# EAGLE design sbus-inverter-pro-micro (EAGLE 9.5.2)
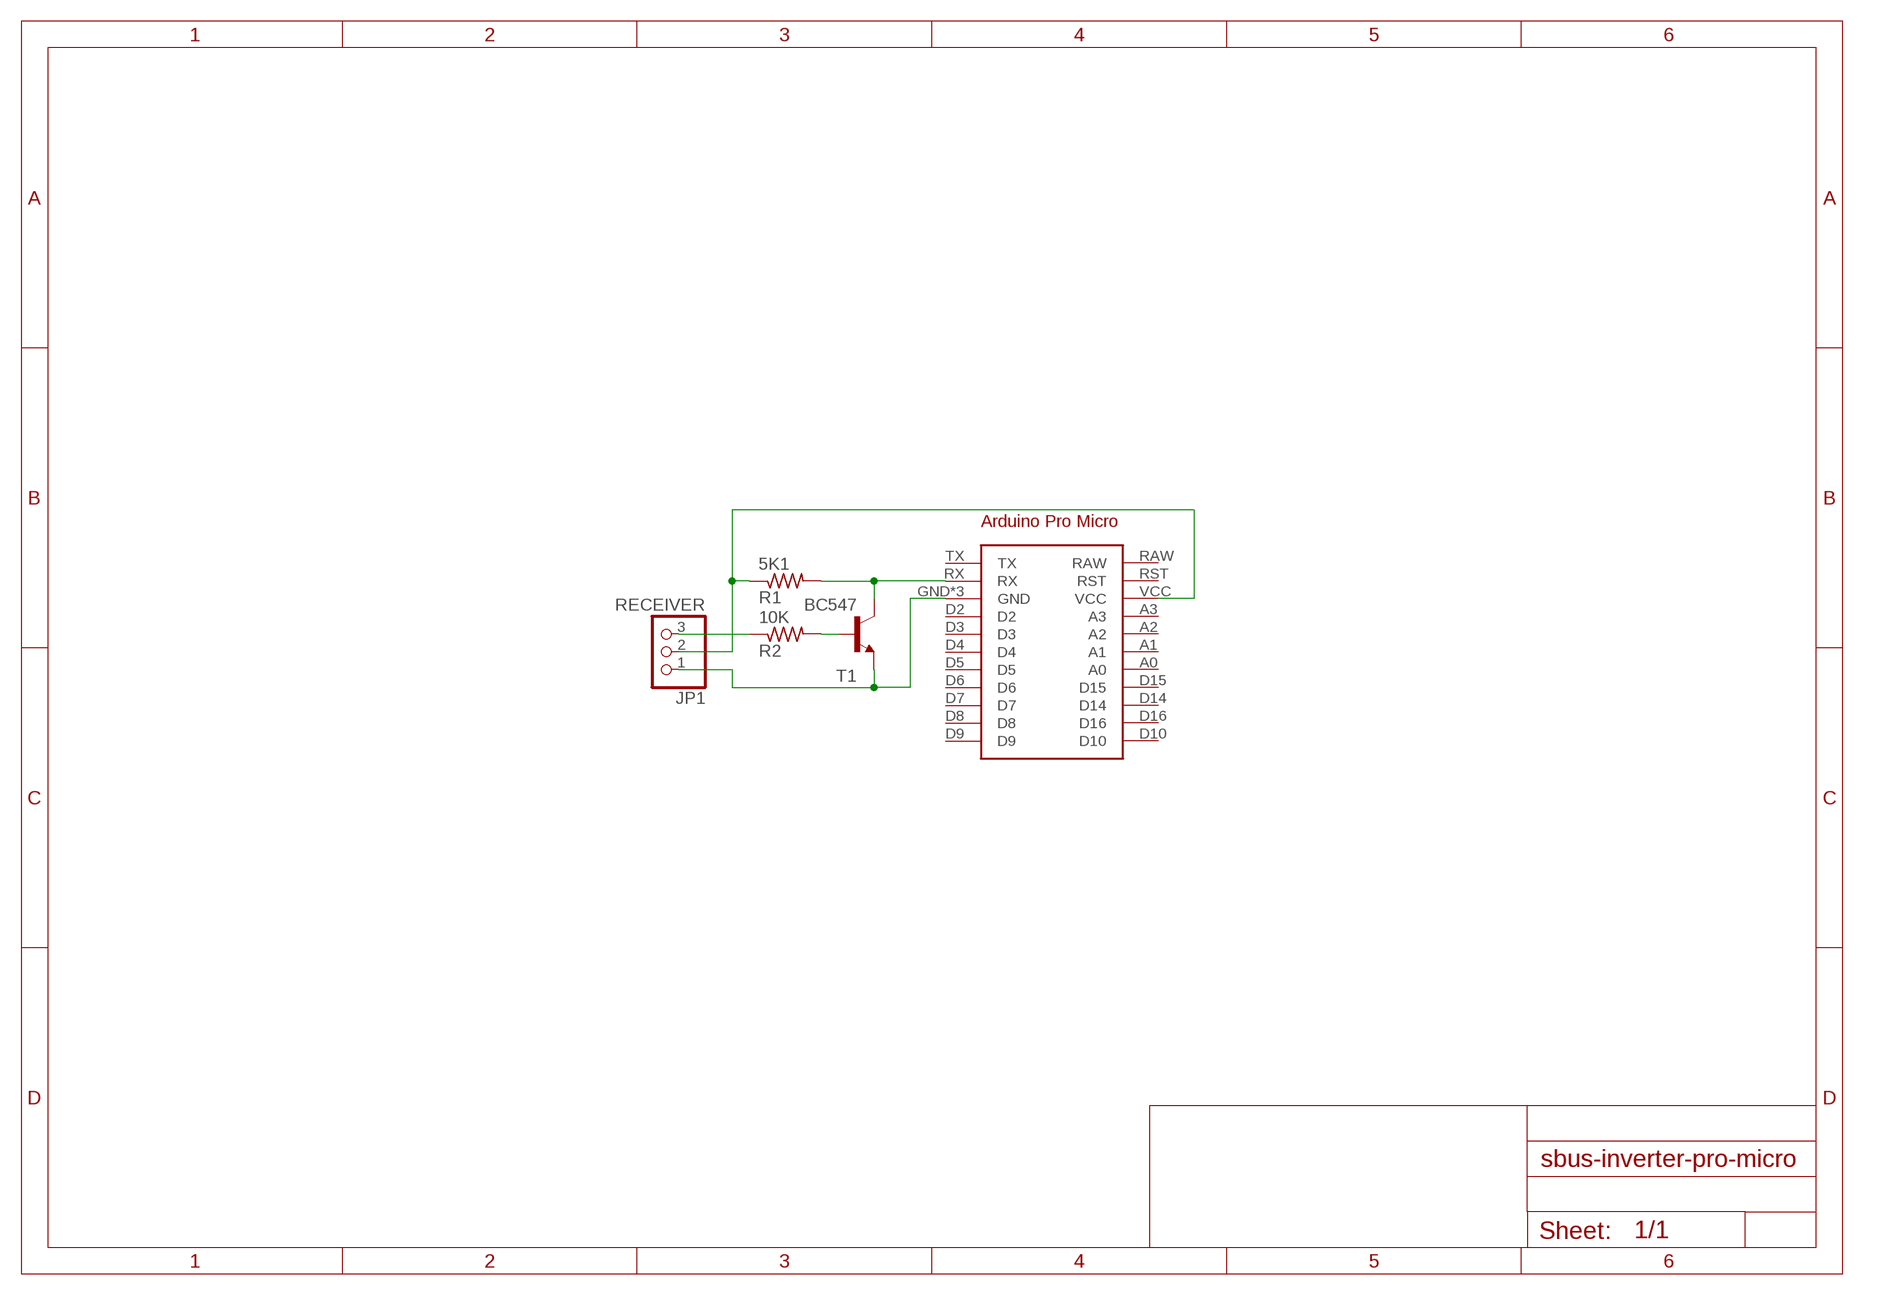
[diagram p0: schematic, sheet 1]

## Parts
ARDUINO1  ARDUINO_PRO_MICRO  [ARDUINO_PRO_MICRO]
JP1  RECEIVER  PINHD-1X3/90  [1X03/90]
R1  5K1  R-US_0207/10  [0207/10]
R2  10K  R-US_0207/10  [0207/10]
T1  BC547  [TO92]

## Nets
N$1: R2.2 T1.2(B)
N$2: ARDUINO1.GND ARDUINO1.GND@1(GND) ARDUINO1.GND@2(GND) JP1.1 T1.1(E)
N$3: ARDUINO1.RX R1.2 T1.3(C)
N$4: JP1.3 R2.1
N$5: ARDUINO1.VCC JP1.2 R1.1
Unconnected: ARDUINO1.A0 ARDUINO1.A1 ARDUINO1.A2 ARDUINO1.A3 ARDUINO1.D2 ARDUINO1.D3 ARDUINO1.D4 ARDUINO1.D5 ARDUINO1.D6 ARDUINO1.D7 ARDUINO1.D8 ARDUINO1.D9 ARDUINO1.D10 ARDUINO1.D14 ARDUINO1.D15 ARDUINO1.D16 ARDUINO1.RAW ARDUINO1.RST ARDUINO1.TX

## Library data of the parts
ARDUINO1 = arduinopromicro:ARDUINO_PRO_MICRO: For creating Arduino Pro Micro shields
JP1 = pinhead:PINHD-1X3: PIN HEADER
R1 R2 = rcl:R-US_: RESISTOR, American symbol; SPICEPREFIX: R
T1 = transistor:BC547: NPN TRANSISTOR

## Board
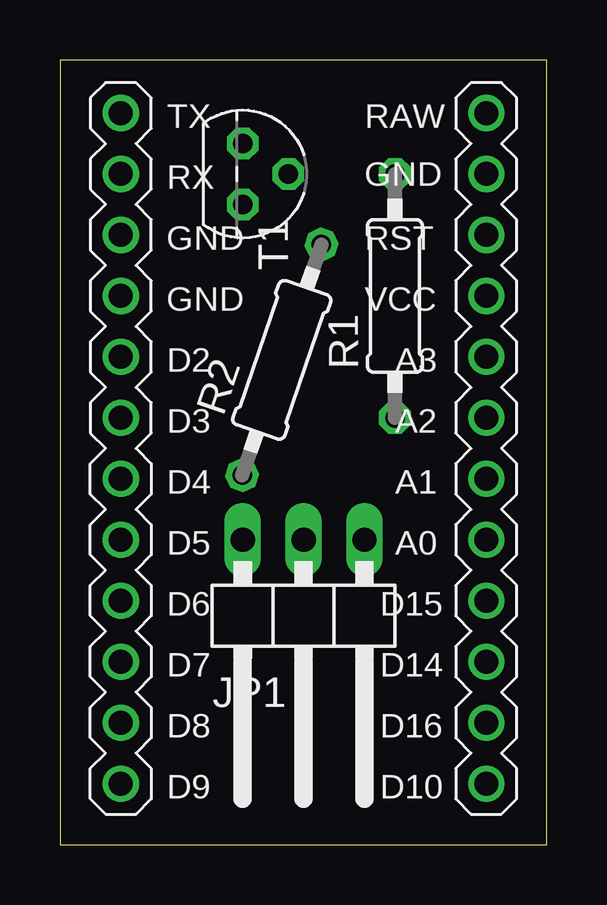
[diagram p1: board, top side]
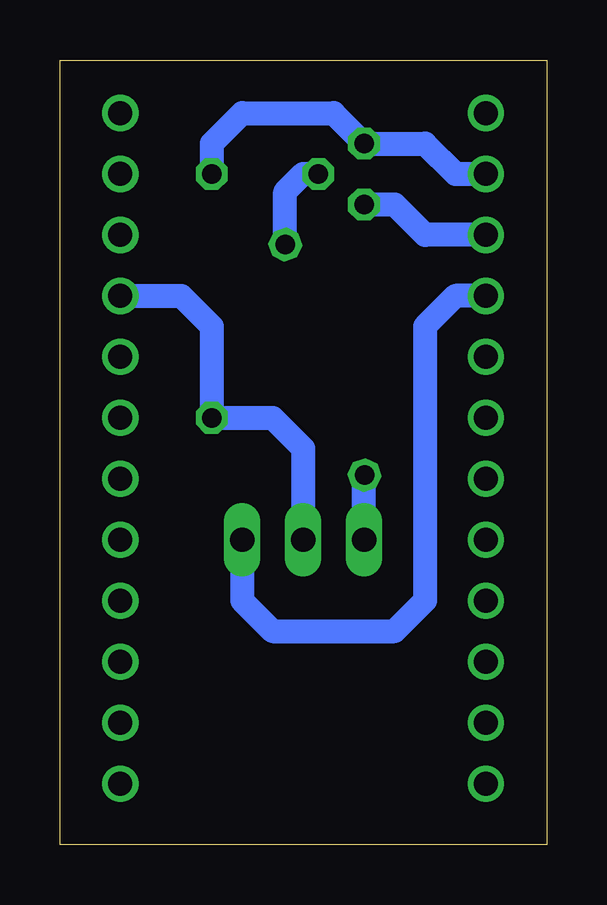
[diagram p2: board, bottom side, seen from below]

Size 20.3 x 32.69 mm. Coordinates in mm from the lower left corner, seen from the top.
Outline: 0,0 20.3,0 20.3,32.69 0,32.69 0,0
Copper layers (1*16): Top 0.035mm / dielectric 1.5mm / Bottom 0.035mm
Design rules "default": minimum track width 6mil, minimum drill 0.35mm, track to track 6mil, track to pad 6mil, pad to pad 6mil, via to via 6mil, smd to smd 6mil, copper to edge 40mil, drill to drill 6mil, minimum pad ring 10mil, minimum via ring 8mil, stop-mask expansion 4mil, vias tented up to drill 0mil, thermal gap 10mil

### Footprints (pad centres in the part's own frame; a part is rotated, then mirrored left to right if it is on the bottom)
ARDUINO_PRO_MICRO = drill 1: A0 7.62,-5.08; A1 7.62,-2.54; A2 7.62,0; A3 7.62,2.54; D2 -7.62,2.54; D3 -7.62,0; D4 -7.62,-2.54; D5 -7.62,-5.08; D6 -7.62,-7.62; D7 -7.62,-10.16; D8 -7.62,-12.7; D9 -7.62,-15.24; D10 7.62,-15.24; D14 7.62,-10.16; D15 7.62,-7.62; D16 7.62,-12.7; GND 7.62,10.16; GND@1 -7.62,7.62; GND@2 -7.62,5.08; RAW 7.62,12.7; RST 7.62,7.62; RX -7.62,10.16; TX -7.62,12.7; VCC 7.62,5.08
1X03/90 = drill 1.016 long: 1 -2.54,-3.81; 2 0,-3.81; 3 2.54,-3.81
0207/10 = drill 0.813 octagon: 1 -5.08,0; 2 5.08,0
TO92 = drill 0.813 octagon: 1 1.27,0; 2 0,1.905; 3 -1.27,0

### Placement (x,y rotation side)
ARDUINO1  10.16,17.78 0 top
JP1  10.16,8.89 180 top
R1  13.97,22.86 90 top
R2  9.25,20.2 71 top
T1  7.62,27.94 270 top

### Tracks (layer width: path | path; a pad name or v marks a point on that pad's centre or on a via)
N$1
  Bottom 1: R2.2 10.9,27.2 10.16,27.94 T1.2
N$2
  Bottom 1: ARDUINO1.GND@1 5.08,25.4 6.35,26.67 T1.1 | JP1.1 12.7,10.16 11.43,8.89 6.35,8.89 5.08,10.16 5.08,21.59 3.81,22.86 ARDUINO1.GND@2
N$3
  Bottom 1: ARDUINO1.RX 3.81,27.94 5.08,29.21 T1.3 8.89,30.48 12.7,30.48 13.97,29.21 R1.2
N$4
  Bottom 1: R2.1 7.62,15.37 JP1.3
N$5
  Bottom 1: JP1.2 10.16,16.51 11.43,17.78 R1.1 13.97,21.59 15.24,22.86 ARDUINO1.VCC